# Altium schematic sheet Sch.SchDoc
size A4
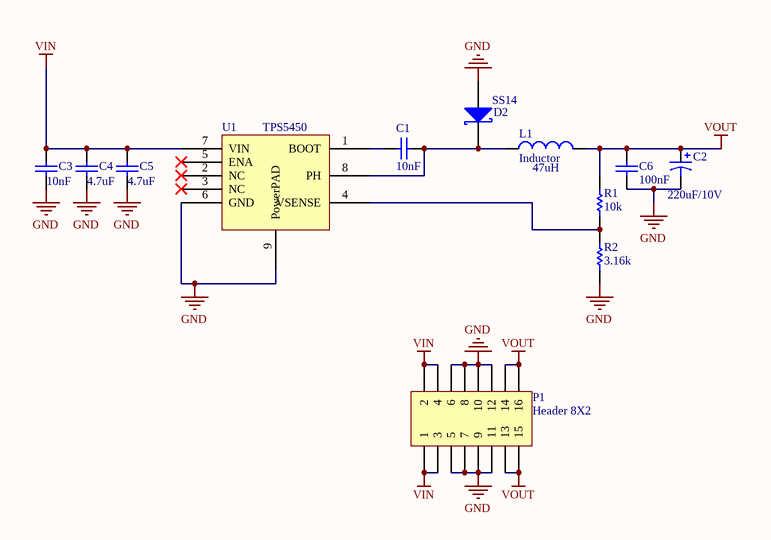
[diagram p0: Sch.SchDoc]

## Parts
C1  10nF  [CAP1608(0603)]
C2  220uF/10V  [CAP 5.0*10*12.5 - BK]
C3  10nF  [CAP1608(0603)]
C4  4.7uF  [CAPC3216N]
C5  4.7uF  [CAPC3216N]
C6  100nF  [CAP1608(0603)]
D2  SS14  [DIODE_SMA]
L1  Inductor  value 47uH  [NR5012]
P1  Header 8X2  [HDR2X8]
R1  10k  [RES1608(0603)]
R2  3.16k  [RES1608(0603)]
U1  TPS5450  [TPS5450]

## Nets
GND: C2.2 C3.2 C4.2 C5.2 C6.2 D2.1(A) P1.5 P1.6 P1.7 P1.8 P1.9 P1.10 P1.11 P1.12 R2.1 U1.6(GND) U1.9(PowerPAD)
VIN: C3.1 C4.1 C5.1 P1.1 P1.2 P1.3 P1.4 U1.7(VIN)
VOUT: C2.1 C6.1 L1.2 P1.13 P1.14 P1.15 P1.16 R1.2
NetC1_1: C1.1 U1.1(BOOT)
NetC1_2: C1.2 D2.2(K) L1.1 U1.8(PH)
NetR1_1: R1.1 R2.2 U1.4(VSENSE)

Not connected (* = marked no-connect by the designer): U1 2(NC)* 3(NC)* 5(ENA)*

## Library data of the parts
C1 C3-C6 = Cap: Capacitor; Published: 8-Jun-2000; LatestRevisionDate: 17-Jul-2002; LatestRevisionNote: Re-released for DXP Platform.; PackageReference: RAD-0.3; Publisher: Altium Limited; PackageDescription: Radial Cap, Thru-Hole; 2 Leads; 0.3 in Pin Spacing
  C1 C3: Value: 10nF
  C4 C5: Value: 4.7uF
  C6: Value: 100nF
C2 = Cap Pol1: Polarized Capacitor (Radial); Published: 8-Jun-2000; LatestRevisionDate: 17-Jul-2002; LatestRevisionNote: Re-released for DXP Platform.; PackageReference: RB7.6-15; Publisher: Altium Limited; PackageDescription: Polarized Capacitor (Radial); 2 Leads; Value: 220uF/10V
D2 = D Schottky: Schottky Diode; Published: 8-Jun-2000; LatestRevisionDate: 17-Jul-2002; LatestRevisionNote: Re-released for DXP Platform.; PackageReference: SMB; Publisher: Altium Limited; PackageDescription: DO-214-AA/SMB; 2 C-Bend Leads; Body 5.3 x 3.6 mm, inc. leads (LxW); Code_JEDEC: DO-214-AA
L1 = Inductor: Code_IEC: 1005; Published: 8-Jun-2000; LatestRevisionDate: 29-May-2009; LatestRevisionNote: IPC-7351 Footprint Added.; PackageReference: 0402-A; Publisher: Altium Limited; PackageDescription: Chip Inductor; Code_JEITA: 0402
P1 = Header 8X2: Header, 8-Pin, Dual row; LatestRevisionDate: 17-Jul-2002; LatestRevisionNote: Re-released for DXP Platform.; Publisher: Altium Limited
R1 R2 = Res1: Resistor; Published: 8-Jun-2000; LatestRevisionDate: 17-Jul-2002; LatestRevisionNote: Re-released for DXP Platform.; PackageReference: AXIAL-0.3; Publisher: Altium Limited; PackageDescription: Axial Device, Thru-Hole; 2 Leads; 0.3 in Pin Spacing
  R1: Value: 10k
  R2: Value: 3.16k